# Altium schematic sheet Interface1.SchDoc
size A4; SheetNumber: 8; SheetTotal: 8
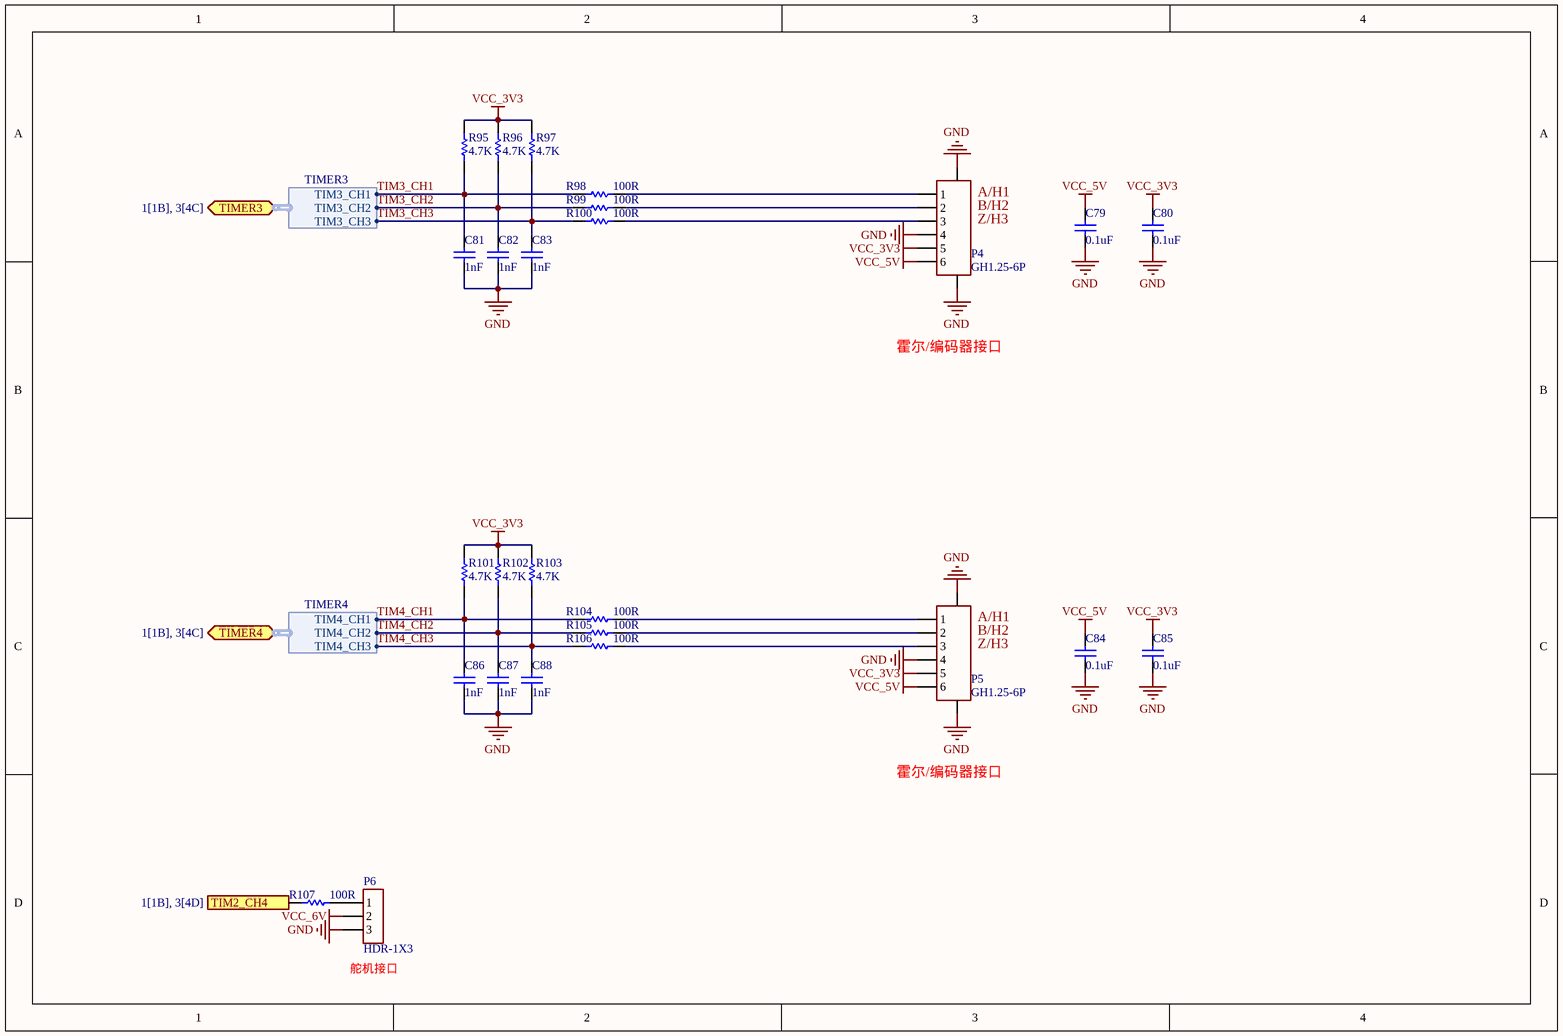
[diagram p0: Interface1.SchDoc]

## Parts
C79  0.1uF  [C0603_NS]
C80  0.1uF  [C0603_NS]
C81  1nF  [C0603_NS]
C82  1nF  [C0603_NS]
C83  1nF  [C0603_NS]
C84  0.1uF  [C0603_NS]
C85  0.1uF  [C0603_NS]
C86  1nF  [C0603_NS]
C87  1nF  [C0603_NS]
C88  1nF  [C0603_NS]
P4  GH1.25-6P  [A1257WR-S-6P]
P5  GH1.25-6P  [A1257WR-S-6P]
P6  HDR-1X3  [HDR2.54-WI-3P]
R95  4.7K  [R0603_NS]
R96  4.7K  [R0603_NS]
R97  4.7K  [R0603_NS]
R98  100R  [R0603_NS]
R99  100R  [R0603_NS]
R100  100R  [R0603_NS]
R101  4.7K  [R0603_NS]
R102  4.7K  [R0603_NS]
R103  4.7K  [R0603_NS]
R104  100R  [R0603_NS]
R105  100R  [R0603_NS]
R106  100R  [R0603_NS]
R107  100R  [R0603_NS]

## Ports
TIM2_CH4 (in, see 1[1B], 3[4D]), TIMER3 (bidir, harness TIMER3, see 1[1B], 3[4C]), TIMER4 (bidir, harness TIMER4, see 1[1B], 3[4C])

## Harnesses
TIMER4: TIM4_CH1, TIM4_CH2, TIM4_CH3
TIMER3: TIM3_CH1, TIM3_CH2, TIM3_CH3

## Nets
GND: C79.1 C80.1 C81.1 C82.1 C83.1 C84.1 C85.1 C86.1 C87.1 C88.1 P4.0 P4.4 P5.0 P5.4 P6.3
VCC_3V3: C80.2 C85.2 P4.5 P5.5 R95.2 R96.2 R97.2 R101.2 R102.2 R103.2
VCC_5V: C79.2 C84.2 P4.6 P5.6
VCC_6V: P6.2
TIM2_CH4: R107.1 ; port TIM2_CH4
TIM3_CH1: C81.2 R95.1 R98.1 ; port TIMER3.TIM3_CH1
TIM3_CH2: C82.2 R96.1 R99.1 ; port TIMER3.TIM3_CH2
TIM3_CH3: C83.2 R97.1 R100.1 ; port TIMER3.TIM3_CH3
TIM4_CH1: C86.2 R101.1 R104.1 ; port TIMER4.TIM4_CH1
TIM4_CH2: C87.2 R102.1 R105.1 ; port TIMER4.TIM4_CH2
TIM4_CH3: C88.2 R103.1 R106.1 ; port TIMER4.TIM4_CH3
NetP4_1: P4.1 R98.2
NetP4_2: P4.2 R99.2
NetP4_3: P4.3 R100.2
NetP5_1: P5.1 R104.2
NetP5_2: P5.2 R105.2
NetP5_3: P5.3 R106.2
NetP6_1: P6.1 R107.2

## Notes on the sheet
- (near P4) A/H1
- (near P4) B/H2
- (near P4) Z/H3
- 霍尔/编码器接口
- (near P5) A/H1
- (near P5) B/H2
- (near P5) Z/H3
- (near P6) 舵机接口

## Library data of the parts
C79-C88 = Cap: Capacitor
P4 P5 = Header6
R95-R107 = Res1: Resistor